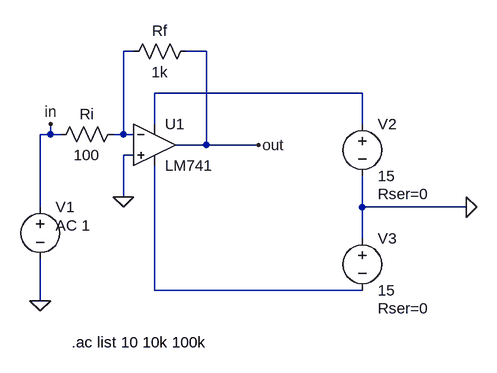
[diagram p0: schematic LM741inverting.asc]
LM741inverting.asc, the LTspice schematic file:
Version 4
SHEET 1 880 680
WIRE 160 0 144 0
WIRE 272 0 240 0
WIRE 512 64 192 64
WIRE 192 112 192 64
WIRE 512 112 512 64
WIRE 32 128 32 112
WIRE 32 128 16 128
WIRE 48 128 32 128
WIRE 144 128 144 0
WIRE 144 128 128 128
WIRE 160 128 144 128
WIRE 272 144 272 0
WIRE 272 144 224 144
WIRE 352 144 272 144
WIRE 160 160 144 160
WIRE 144 224 144 160
WIRE 16 240 16 128
WIRE 512 240 512 192
WIRE 672 240 512 240
WIRE 512 288 512 240
WIRE 192 368 192 176
WIRE 512 368 192 368
WIRE 16 384 16 320
FLAG 16 384 0
FLAG 32 112 in
FLAG 352 144 out
FLAG 672 240 0
FLAG 144 224 0
SYMBOL LM741 192 80 R0
SYMATTR InstName U1
SYMBOL voltage 512 96 R0
WINDOW 123 0 0 Left 0
WINDOW 39 24 124 Left 2
SYMATTR SpiceLine Rser=0
SYMATTR InstName V2
SYMATTR Value 15
SYMBOL voltage 16 224 R0
WINDOW 3 24 44 Left 2
WINDOW 123 24 44 Left 2
WINDOW 39 0 0 Left 0
SYMATTR Value ""
SYMATTR Value2 AC 1
SYMATTR InstName V1
SYMBOL res 256 -16 R90
WINDOW 0 0 56 VBottom 2
WINDOW 3 32 56 VTop 2
SYMATTR InstName Rf
SYMATTR Value 1k
SYMBOL res 144 112 R90
WINDOW 0 0 56 VBottom 2
WINDOW 3 32 56 VTop 2
SYMATTR InstName Ri
SYMATTR Value 100
SYMBOL voltage 512 272 R0
WINDOW 123 0 0 Left 0
WINDOW 39 24 124 Left 2
SYMATTR SpiceLine Rser=0
SYMATTR InstName V3
SYMATTR Value 15
TEXT 64 448 Left 2 !.ac list 10 10k 100k

The netlist it stands for:
* LM741inverting.asc
XU1 0 N001 N002 N003 out LM741  ; pins In+ In- V+ V- OUT
V2 N002 0 15 Rser=0
V1 in 0 AC 1
Rf out N001 1k
Ri N001 in 100
V3 0 N003 15 Rser=0
.ac list 10 10k 100k
.lib LM741.lib
.backanno
.end